# EAGLE design Sensor Arduino (EAGLE 9.6.2)
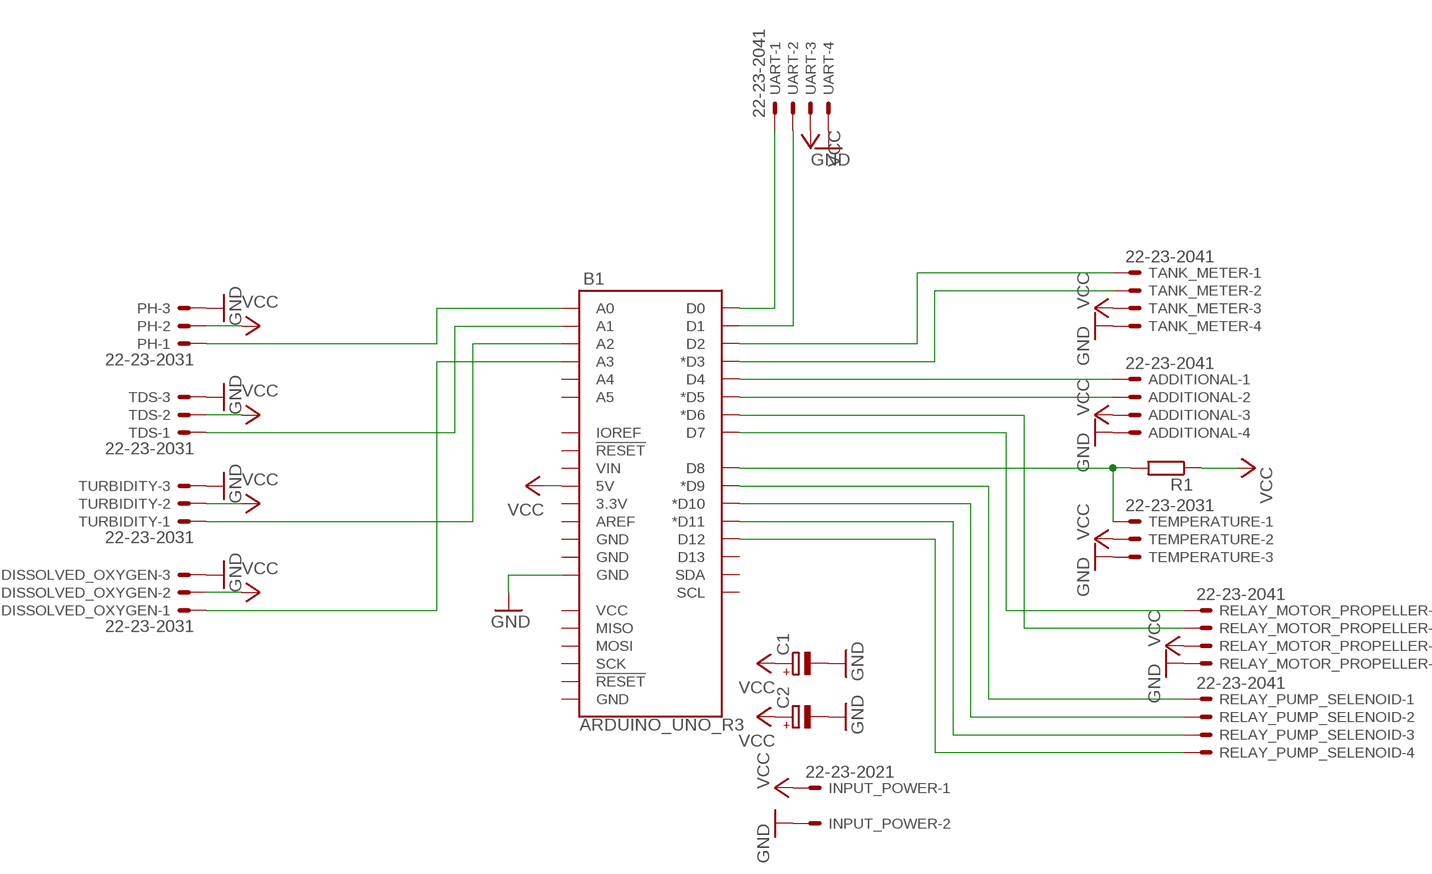
[diagram p0: schematic, sheet 1]

## Parts
ADDITIONAL  22-23-2041  [22-23-2041]
B1  ARDUINO_UNO_R3  [ARDUINO_R3]
C1  CPOL-EUE5-10.5  [E5-10,5]
C2  CPOL-EUE5-6  [E5-6]
DISSOLVED_OXYGEN  22-23-2031  [22-23-2031]
INPUT_POWER  22-23-2021  [22-23-2021]
PH  22-23-2031  [22-23-2031]
R1  R-EU_0207/12  [0207/12]
RELAY_MOTOR_PROPELLER  22-23-2041  [22-23-2041]
RELAY_PUMP_SELENOID  22-23-2041  [22-23-2041]
TANK_METER  22-23-2041  [22-23-2041]
TDS  22-23-2031  [22-23-2031]
TEMPERATURE  22-23-2031  [22-23-2031]
TURBIDITY  22-23-2031  [22-23-2031]
UART  22-23-2041  [22-23-2041]

## Nets
GND: ADDITIONAL.4 B1.GND@2(GND) C1.- C2.- DISSOLVED_OXYGEN.3 INPUT_POWER.2 PH.3 RELAY_MOTOR_PROPELLER.4 TANK_METER.4 TDS.3 TEMPERATURE.3 TURBIDITY.3 UART.4
N$1: B1.A0 PH.1
N$2: B1.A1 TDS.1
N$3: B1.A2 TURBIDITY.1
N$4: B1.A3 DISSOLVED_OXYGEN.1
N$5: B1.D2 TANK_METER.1
N$6: B1.D3(*D3) TANK_METER.2
N$7: ADDITIONAL.1 B1.D4
N$8: ADDITIONAL.2 B1.D5(*D5)
N$9: B1.D8 R1.2 TEMPERATURE.1
N$10: B1.D6(*D6) RELAY_MOTOR_PROPELLER.2
N$11: B1.D7 RELAY_MOTOR_PROPELLER.1
N$12: B1.D9(*D9) RELAY_PUMP_SELENOID.1
N$13: B1.D10(*D10) RELAY_PUMP_SELENOID.2
N$14: B1.D11(*D11) RELAY_PUMP_SELENOID.3
N$15: B1.D12 RELAY_PUMP_SELENOID.4
N$16: B1.D1 UART.2
N$17: B1.D0 UART.1
VCC: ADDITIONAL.3 B1.5V C1.+ C2.+ DISSOLVED_OXYGEN.2 INPUT_POWER.1 PH.2 R1.1 RELAY_MOTOR_PROPELLER.3 TANK_METER.3 TDS.2 TEMPERATURE.2 TURBIDITY.2 UART.3
Unconnected: B1.3.3V B1.A4 B1.A5 B1.AREF B1.D13 B1.GND@1(GND) B1.GND@3(GND) B1.GND@4(GND) B1.IOREF B1.MISO B1.MOSI B1.RESET@1(!RESET!) B1.RESET@2(!RESET!) B1.SCK B1.SCL B1.SDA B1.VCC B1.VIN

## Library data of the parts
ADDITIONAL RELAY_MOTOR_PROPELLER RELAY_PUMP_SELENOID TANK_METER UART = con-molex:22-23-2041: .100" (2.54mm) Center Header - 4 Pin; MF: MOLEX; MPN: 22-23-2041; OC_FARNELL: 1462920; OC_NEWARK: 38C0355
B1 = SparkFun-Boards:ARDUINO_UNO_R3: Arduino R3 Footprint with SPI header Arduino Uno R3 Compatible Footprint. Matches PCB size of the original board. SparkFun Products: SAMD21 Dev Breakout <https://www.sparkfun.com/products/13672> RedBoard <https://www.sparkfun.com/products/12757> R3 Stackable Headers <https://www.sparkfun.com/products/11417>
C1 C2 = rcl:CPOL-EU: POLARIZED CAPACITOR, European symbol; SPICEPREFIX: C
DISSOLVED_OXYGEN PH TDS TEMPERATURE TURBIDITY = con-molex:22-23-2031: .100" (2.54mm) Center Header - 3 Pin; MF: MOLEX; MPN: 22-23-2031; OC_FARNELL: 1462950; OC_NEWARK: 30C0862
INPUT_POWER = con-molex:22-23-2021: .100" (2.54mm) Center Header - 2 Pin; MF: MOLEX; MPN: 22-23-2021; OC_FARNELL: 1462926; OC_NEWARK: 25C3832
R1 = rcl:R-EU_: RESISTOR, European symbol; SPICEPREFIX: R

## Board
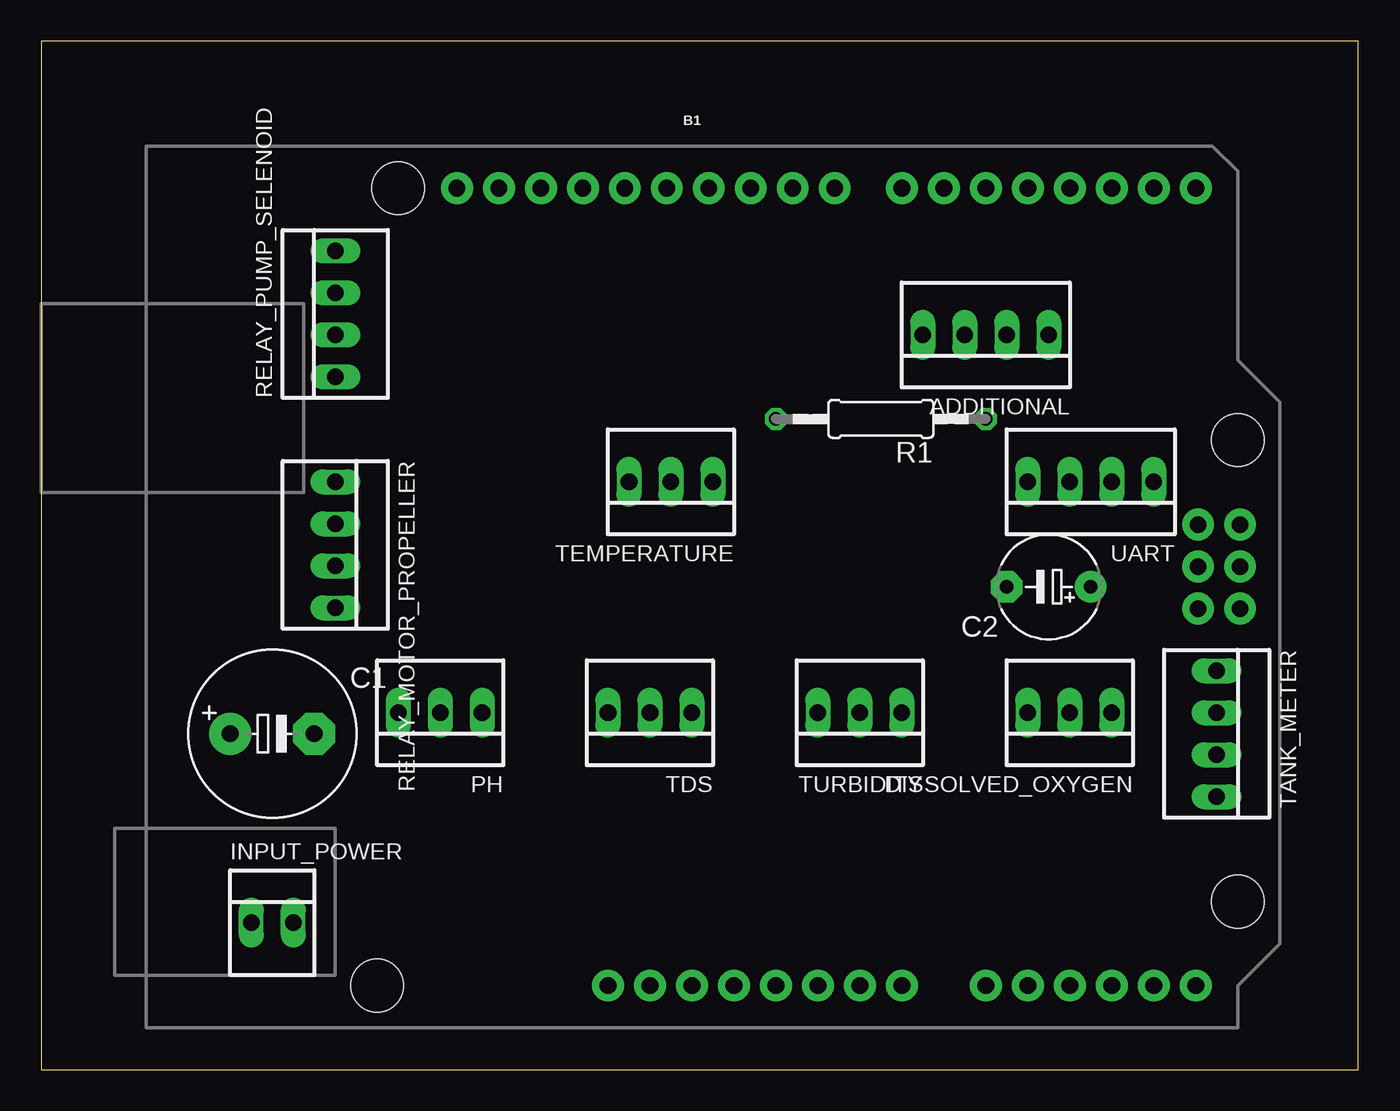
[diagram p1: board, top side]
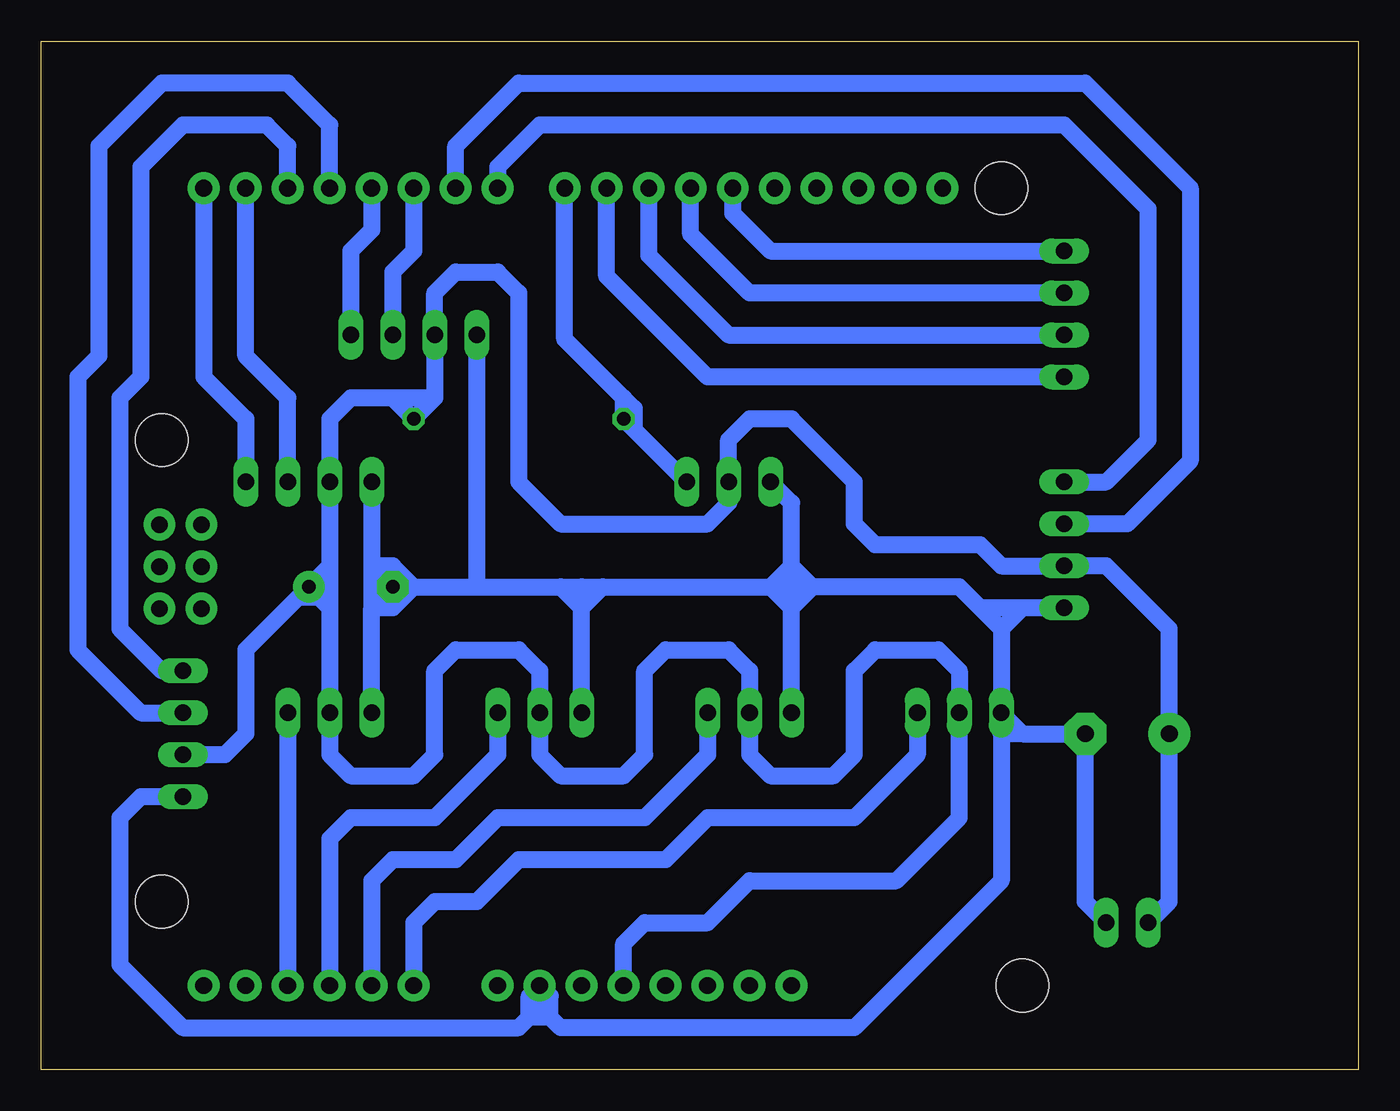
[diagram p2: board, bottom side, seen from below]

Size 79.68 x 62.22 mm. Coordinates in mm from the lower left corner, seen from the top.
Outline: 0,0 79.68,0 79.68,62.22 0,62.22 0,0
Copper layers (1*16): Top 0.035mm / dielectric 1.5mm / Bottom 0.035mm
Design rules "default": minimum track width 6mil, minimum drill 0.35mm, track to track 6mil, track to pad 6mil, pad to pad 6mil, via to via 6mil, smd to smd 6mil, copper to edge 40mil, drill to drill 6mil, minimum pad ring 10mil, minimum via ring 8mil, stop-mask expansion 4mil, vias tented up to drill 0mil, thermal gap 10mil

### Footprints (pad centres in the part's own frame; a part is rotated, then mirrored left to right if it is on the bottom)
22-23-2041 = drill 1 long: 1 -3.81,0; 2 -1.27,0; 3 1.27,0; 4 3.81,0
ARDUINO_R3 = drill 1.016 pad 1.93: 3.3V 2.54,-24.13; 5V 5.08,-24.13; A0 17.78,-24.13; A1 20.32,-24.13; A2 22.86,-24.13; A3 25.4,-24.13; A4 27.94,-24.13; A5 30.48,-24.13; AREF -9.144,24.13; D0 30.48,24.13; D1 27.94,24.13; D2 25.4,24.13; D3 22.86,24.13; D4 20.32,24.13; D5 17.78,24.13; D6 15.24,24.13; D7 12.7,24.13; D8 8.636,24.13; D9 6.096,24.13; D10 3.556,24.13; D11 1.016,24.13; D12 -1.524,24.13; D13 -4.064,24.13; GND@1 7.62,-24.13; GND@2 10.16,-24.13; GND@3 -6.604,24.13; GND@4 33.16,-1.32; IOREF -2.54,-24.13; MISO 30.62,3.76; MOSI 33.16,1.22; NC -5.08,-24.13; RESET@1 0,-24.13; RESET@2 30.62,-1.32; SCK 30.62,1.22; SCL -14.224,24.13; SDA -11.684,24.13; VCC 33.16,3.76; VIN 12.7,-24.13 | hole 3.175: -17.78,24.13; 33.02,8.89; 33.02,-19.05; -19.05,-24.13
E5-10,5 = drill 1.016 pad 2.54: + -2.54,0 | drill 1.016 pad 2.54 octagon: - 2.54,0
E5-6 = drill 0.813 pad 1.905: + -2.54,0 | drill 0.813 pad 1.905 octagon: - 2.54,0
22-23-2031 = drill 1 long: 1 -2.54,0; 2 0,0; 3 2.54,0
22-23-2021 = drill 1 long: 1 -1.27,0; 2 1.27,0
0207/12 = drill 0.813 octagon: 1 -6.35,0; 2 6.35,0

### Placement (x,y rotation side)
ADDITIONAL  57.15,44.45 180 top
B1  39.37,29.21 0 top
C1  13.97,20.32 0 top
C2  60.96,29.21 180 top
DISSOLVED_OXYGEN  62.23,21.59 180 top
INPUT_POWER  13.97,8.89 0 top
PH  24.13,21.59 180 top
R1  50.8,39.37 180 top
RELAY_MOTOR_PROPELLER  17.78,31.75 270 top
RELAY_PUMP_SELENOID  17.78,45.72 90 top
TANK_METER  71.12,20.32 270 top
TDS  36.83,21.59 180 top
TEMPERATURE  38.1,35.56 180 top
TURBIDITY  49.53,21.59 180 top
UART  63.5,35.56 180 top

### Tracks (layer width: path | path; a pad name or v marks a point on that pad's centre or on a via)
GND
  Bottom 1.016: DISSOLVED_OXYGEN.3 59.69,27.94 | 59.69,27.94 C2.- | 22.86,27.94 24.13,29.21 33.02,29.21 | 22.86,27.94 21.59,26.67 | 21.59,26.67 PH.3 | 53.34,29.21 48.26,29.21 | 48.26,29.21 46.99,29.21 | 46.99,29.21 45.72,29.21 | 45.72,29.21 35.56,29.21 | 35.56,29.21 34.29,29.21 | 33.02,29.21 34.29,29.21 | TDS.3 34.29,27.94 | 34.29,29.21 34.29,27.94 | TURBIDITY.3 46.99,27.94 | 46.99,27.94 46.99,29.21 | PH.3 21.59,20.32 | 21.59,20.32 21.59,11.43 30.48,2.54 48.26,2.54 48.89,3.18 | 48.89,3.18 49.53,3.81 | 49.53,3.81 B1.GND@2 | UART.4 59.69,30.48 | 59.69,30.48 C2.- | 59.69,30.48 59.69,27.94 | TEMPERATURE.3 34.29,34.29 34.29,30.48 | 34.29,29.21 34.29,30.48 | 34.29,30.48 35.56,29.21 | 35.56,29.21 34.29,27.94 | 34.29,27.94 33.02,29.21 | 33.02,29.21 34.29,30.48 | 46.99,27.94 48.26,29.21 | 46.99,27.94 45.72,29.21 | RELAY_MOTOR_PROPELLER.4 20.32,27.94 | 20.32,27.94 21.59,26.67 | 20.32,27.94 22.86,27.94 | TANK_METER.4 73.66,16.51 74.93,15.24 74.93,6.35 71.12,2.54 50.8,2.54 50.16,3.18 | 50.16,3.18 49.53,3.81 | 48.89,3.18 48.89,4.45 B1.GND@2 | 50.16,3.18 50.16,4.45 B1.GND@2 | 48.89,3.18 50.16,3.18 | ADDITIONAL.4 53.34,29.21 | C2.- 57.15,29.21 | 57.15,29.21 53.34,29.21 | 57.15,29.21 58.42,30.48 59.69,30.48 | 57.15,29.21 58.42,27.94 59.69,27.94 | PH.3 20.32,20.32 | 20.32,20.32 C1.- 16.51,10.16 INPUT_POWER.2 | 20.32,20.32 21.59,20.32
N$1
  Bottom 1.016: PH.1 26.67,19.05 30.48,15.24 39.37,15.24 41.91,12.7 50.8,12.7 53.34,10.16 55.88,10.16 57.15,8.89 B1.A0
N$2
  Bottom 1.016: TDS.1 39.37,19.05 43.18,15.24 52.07,15.24 54.61,12.7 58.42,12.7 59.69,11.43 B1.A1
N$3
  Bottom 1.016: TURBIDITY.1 52.07,19.05 55.88,15.24 60.96,15.24 62.23,13.97 B1.A2
N$4
  Bottom 1.016: DISSOLVED_OXYGEN.1 B1.A3
N$5
  Bottom 1.016: B1.D2 64.77,55.88 66.04,57.15 71.12,57.15 73.66,54.61 73.66,41.91 74.93,40.64 74.93,26.67 72.39,24.13 TANK_METER.1
N$6
  Bottom 1.016: B1.D3 62.23,57.15 64.77,59.69 72.39,59.69 76.2,55.88 76.2,43.18 77.47,41.91 77.47,25.4 73.66,21.59 TANK_METER.2
N$7
  Bottom 1.016: B1.D4 59.69,50.8 60.96,49.53 ADDITIONAL.1
N$8
  Bottom 1.016: B1.D5 57.15,49.53 58.42,48.26 ADDITIONAL.2
N$9
  Bottom 1.016: TEMPERATURE.1 43.81,38.73 | 43.81,38.73 R1.2 44.45,40.64 | 44.45,40.64 48.01,44.2 B1.D8 | 44.45,40.64 43.81,40.01 43.81,38.73
N$10
  Bottom 1.016: RELAY_MOTOR_PROPELLER.2 13.97,33.02 10.16,36.83 10.16,53.34 16.51,59.69 50.8,59.69 54.61,55.88 B1.D6
N$11
  Bottom 1.016: RELAY_MOTOR_PROPELLER.1 15.24,35.56 12.7,38.1 12.7,52.07 17.78,57.15 49.53,57.15 52.07,54.61 B1.D7
N$12
  Bottom 1.016: RELAY_PUMP_SELENOID.1 39.37,41.91 45.47,48.01 B1.D9
N$13
  Bottom 1.016: B1.D10 42.93,49.28 38.1,44.45 RELAY_PUMP_SELENOID.2
N$14
  Bottom 1.016: RELAY_PUMP_SELENOID.3 36.83,46.99 40.39,50.55 B1.D11
N$15
  Bottom 1.016: B1.D12 37.85,51.82 35.56,49.53 RELAY_PUMP_SELENOID.4
N$16
  Bottom 1.016: UART.2 64.77,40.64 67.31,43.18 B1.D1
N$17
  Bottom 1.016: B1.D0 69.85,41.91 67.31,39.37 UART.1
VCC
  Bottom 1.016: B1.5V 44.45,7.62 43.18,8.89 39.37,8.89 36.83,11.43 27.94,11.43 24.13,15.24 PH.2 24.13,24.13 25.4,25.4 29.21,25.4 30.48,24.13 30.48,19.05 31.75,17.78 35.56,17.78 36.83,19.05 TDS.2 36.83,24.13 38.1,25.4 41.91,25.4 43.18,24.13 43.18,19.05 44.45,17.78 48.26,17.78 49.53,19.05 TURBIDITY.2 49.53,24.13 50.8,25.4 54.61,25.4 55.88,24.13 55.88,19.05 57.15,17.78 60.96,17.78 62.23,19.05 DISSOLVED_OXYGEN.2 62.23,27.94 | 62.23,30.48 UART.3 62.23,39.37 60.96,40.64 58.42,40.64 | 62.23,30.48 62.23,29.21 | 62.23,29.21 62.23,27.94 | 58.42,40.64 R1.1 55.88,40.64 | 62.23,29.21 C2.+ | C2.+ 64.13,28.58 | 64.13,28.58 67.31,25.4 67.31,20.32 68.58,19.05 TANK_METER.3 | 55.88,40.64 ADDITIONAL.3 55.88,46.99 54.61,48.26 52.07,48.26 50.8,46.99 50.8,35.56 48.26,33.02 39.37,33.02 38.1,34.29 TEMPERATURE.2 38.1,38.1 36.83,39.37 34.29,39.37 30.48,35.56 30.48,33.02 29.21,31.75 22.86,31.75 21.59,30.48 RELAY_MOTOR_PROPELLER.3 15.24,30.48 11.43,26.67 C1.+ 11.43,10.16 INPUT_POWER.1 | 55.88,40.64 58.42,40.64 | 62.23,27.94 62.86,28.58 64.13,28.58 | C2.+ 62.23,30.48